# EAGLE schematic main (EAGLE 5.09)
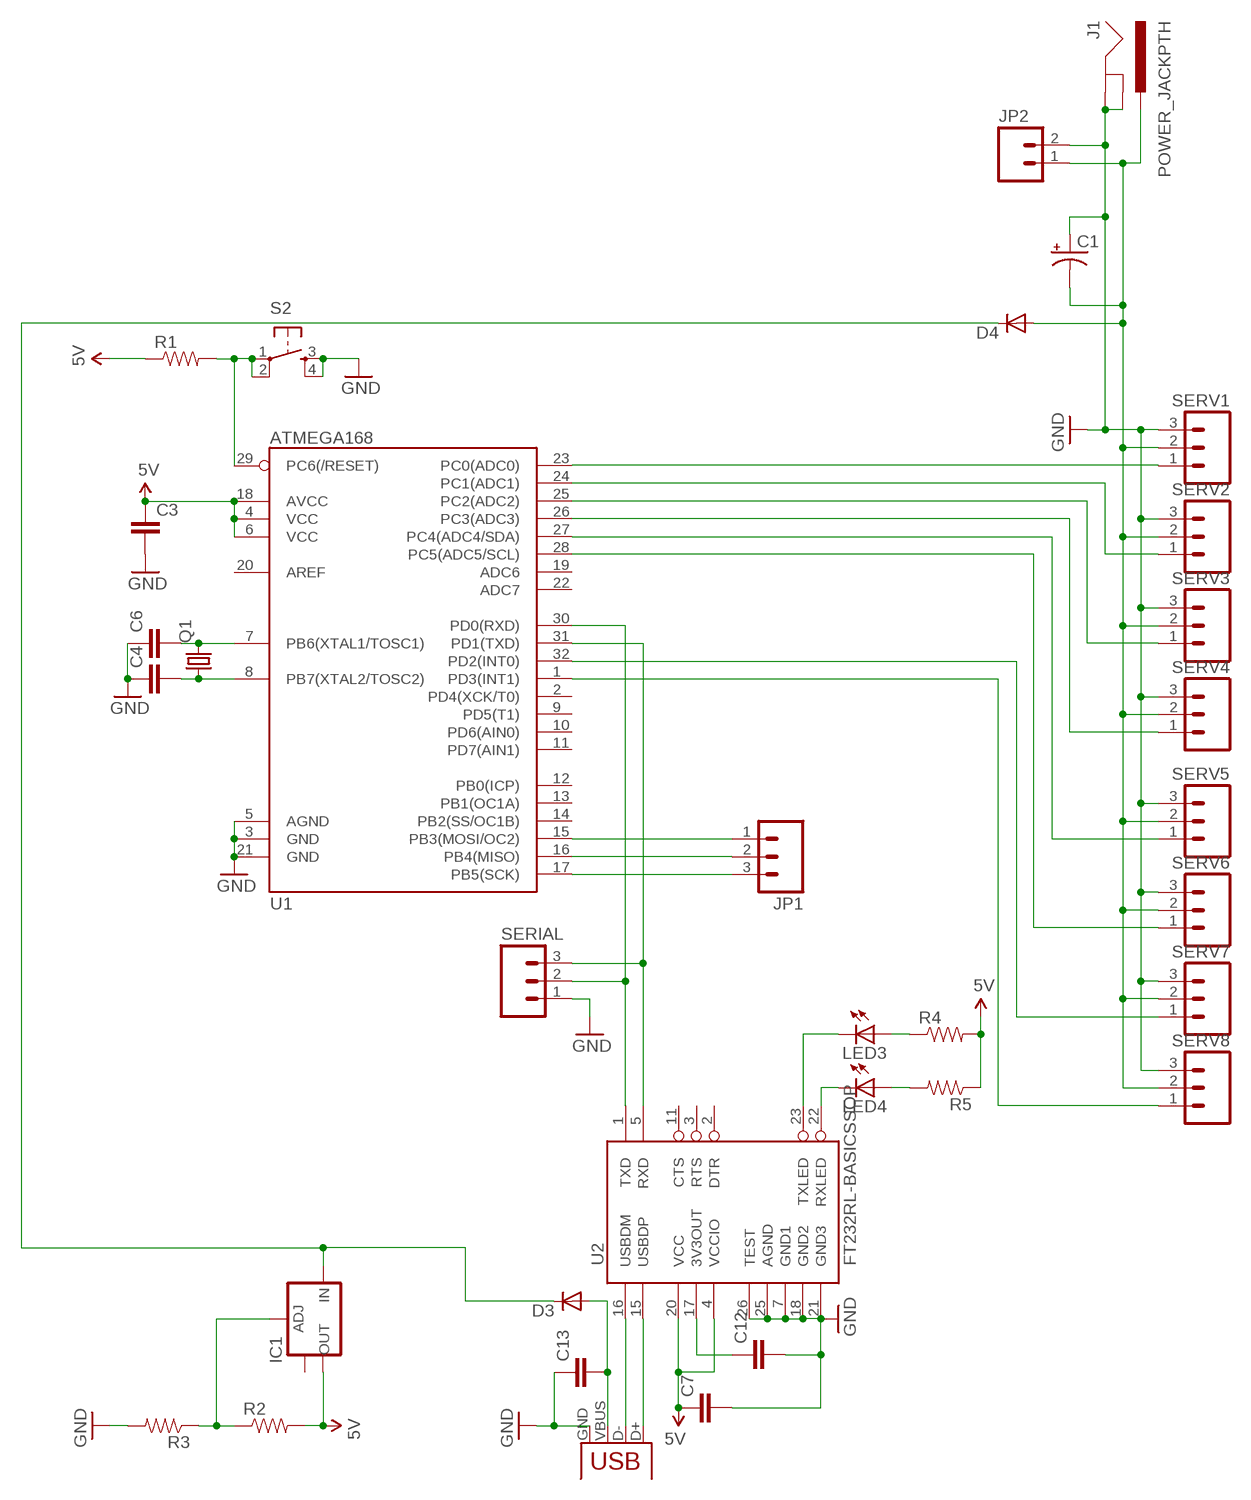
[diagram p0: schematic, sheet 1]

## Parts
C1  CAP_POLPTH2  [CPOL-RADIAL-10UF-25V]
C3  CAP1206  [1206]
C4  CAP1206  [1206]
C6  CAP1206  [1206]
C7  CAP1206  [1206]
C12  CAP1206  [1206]
C13  CAP1206  [1206]
D3  DIODESOT23  [SOT23-3]
D4  DIODESOT23  [SOT23-3]
IC1  V_REG_LM1117SOT223  [SOT223]
J1  POWER_JACKPTH  [POWER_JACK_PTH]
JP1  M03PTH  [1X03]
JP2  M02LOCK  [1X02_LOCK]
LED3  LED1206  [LED-1206]
LED4  LED1206  [LED-1206]
Q1  CRYSTAL5X3  [CRYSTAL-SMD-5X3]
R1  RESISTOR  [0805]
R2  RESISTOR  [0805]
R3  RESISTOR  [0805]
R4  RESISTOR  [0805]
R5  RESISTOR  [0805]
S2  TAC_SWITCHSMD  [TACTILE_SWITCH_SMD]
SERIAL  M03PTH  [1X03]
SERV1  M03LOCK  [1X03_LOCK]
SERV2  M03LOCK  [1X03_LOCK]
SERV3  M03LOCK  [1X03_LOCK]
SERV4  M03LOCK  [1X03_LOCK]
SERV5  M03LOCK  [1X03_LOCK]
SERV6  M03LOCK  [1X03_LOCK]
SERV7  M03LOCK  [1X03_LOCK]
SERV8  M03LOCK  [1X03_LOCK]
U1  ATMEGA168  [TQFP32-08]
U2  FT232RL-BASICSSOP  [SSOP28DB]
X2  USBSMD  [USB-MINIB]

## Nets
5V: C3.1 C7.1 IC1.2(OUT) R1.1 R2.2 R4.2 R5.1 U1.4(VCC) U1.6(VCC) U1.18(AVCC) U2.4(VCCIO) U2.20(VCC)
GND: C1.1(+) C3.2 C4.1 C6.1 C7.2 C12.2 C13.1 J1.GND J1.GNDBREAK JP2.2 R3.2 S2.3 S2.4 SERIAL.1 SERV1.3 SERV2.3 SERV3.3 SERV4.3 SERV5.3 SERV6.3 SERV7.3 SERV8.3 U1.3(GND) U1.5(AGND) U1.21(GND) U2.7(GND1) U2.18(GND2) U2.21(GND3) U2.25(AGND) U2.26(TEST) X2.GND
N$1: LED4.A R5.2
N$2: U2.16(USBDM) X2.D-
N$3: C6.2 Q1.3 U1.7(PB6(XTAL1/TOSC1))
N$4: C4.2 Q1.1 U1.8(PB7(XTAL2/TOSC2))
N$5: SERV1.1 U1.23(PC0(ADC0))
N$6: R1.2 S2.1 S2.2 U1.29(PC6(/RESET))
N$7: SERV2.1 U1.24(PC1(ADC1))
N$8: SERV3.1 U1.25(PC2(ADC2))
N$9: SERV4.1 U1.26(PC3(ADC3))
N$10: U2.15(USBDP) X2.D+
N$11: LED4.C U2.22(RXLED)
N$12: LED3.C U2.23(TXLED)
N$13: C12.1 U2.17(3V3OUT)
N$14: SERIAL.3 U1.31(PD1(TXD)) U2.5(RXD)
N$15: SERIAL.2 U1.30(PD0(RXD)) U2.1(TXD)
N$16: LED3.A R4.1
N$17: SERV5.1 U1.27(PC4(ADC4/SDA))
N$18: SERV6.1 U1.28(PC5(ADC5/SCL))
N$19: JP1.1 U1.15(PB3(MOSI/OC2))
N$20: JP1.2 U1.16(PB4(MISO))
N$21: JP1.3 U1.17(PB5(SCK))
N$22: SERV7.1 U1.32(PD2(INT0))
N$23: C1.2(-) D4.1(A) J1.PWR JP2.1 SERV1.2 SERV2.2 SERV3.2 SERV4.2 SERV5.2 SERV6.2 SERV7.2 SERV8.2
N$24: SERV8.1 U1.1(PD3(INT1))
N$25: C13.2 D3.1(A) X2.VBUS
N$27: IC1.1(ADJ) R2.1 R3.1
N$28: D3.3(C) D4.3(C) IC1.3(IN)
Unconnected: IC1.4(OUT) U1.2(PD4(XCK/T0)) U1.9(PD5(T1)) U1.10(PD6(AIN0)) U1.11(PD7(AIN1)) U1.12(PB0(ICP)) U1.13(PB1(OC1A)) U1.14(PB2(SS/OC1B)) U1.19(ADC6) U1.20(AREF) U1.22(ADC7) U2.2(DTR) U2.3(RTS) U2.11(CTS)

## Library data of the parts
C1 = SparkFun:CAP_POL: Capacitor Polarized These are standard SMD and PTH capacitors. Normally 10uF, 47uF, and 100uF in electrolytic and tantalum varieties. Always verify the external diameter of the through hole cap, it varies with capacity, voltage, and manufacturer. The EIA devices should be standard.
C3 C4 C6 C7 C12 C13 = SparkFun:CAP: Capacitor Standard 0603 ceramic capacitor, and 0.1" leaded capacitor.
D3 D4 = SparkFun:DIODE: Diode These are standard reverse protection diodes and small signal diodes. SMA package can handle up to about 1A. SOD-323 can handle about 200mA. What the SOD-323 package when ordering, there are some mfgs out there that are 5-pin packages.
IC1 = SparkFun:V_REG_LM1117: Voltage Regulator LM1117 Standard adjustable voltage regulator but in SMD form. Spark Fun Electronics SKU : COM-00595
J1 = SparkFun:POWER_JACK: Power Jack This is the standard 5.5mm barrel jack for power. The PTH is the most common, proven, reliable, footprint. All others are experimental. The Slot footprint only works if the mill layer is transmitted to the PCB fab house so be warned. Spark Fun Electronics SKU : PRT-00119. Mating wall wart : TOL-00298 (and others)
JP1 SERIAL SERV1-SERV8 = SparkFun:M03: Header 3 Standard 3-pin 0.1" header. Use with straight break away headers (SKU : PRT-00116), right angle break away headers (PRT-00553), swiss pins (PRT-00743), machine pins (PRT-00117), and female headers (PRT-00115). Molex polarized connector foot print use with SKU : PRT-08232 with associated crimp pins and housings.
JP2 = SparkFun:M02: Header 2 Standard 2-pin 0.1" header. Use with straight break away headers (SKU : PRT-00116), right angle break away headers (PRT-00553), swiss pins (PRT-00743), machine pins (PRT-00117), and female headers (PRT-00115). Molex polarized connector foot print use with SKU : PRT-08233 with associated crimp pins and housings.
LED3 LED4 = SparkFun:LED: LEDs Standard schematic elements and footprints for 5mm, 3mm, 1206, and 0603 sized LEDs. 5mm - Spark Fun Electronics SKU : COM-00529 (and others)
Q1 = SparkFun:CRYSTAL: Crystals Various standard crystals. Proven footprints. Spark Fun Electronics SKU : COM-00534
R1-R5 = SparkFun:RESISTOR: Resistor Basic schematic elements and footprints for 0603, 1206, and PTH 1/10th watt (small) resistors.
S2 = SparkFun:TAC_SWITCH: Momentary Switch Button commonly used for reset or general input. Spark Fun Electronics SKU : COM-00097
U1 = SparkFun:ATMEGA168
U2 = SparkFun:FT232RL-BASIC: USB UART This is the simplified version of the FT232RL unit. Only what you need, nothing you don't. Spark Fun Electronics SKU : COM-00650
X2 = SparkFun:USB: USB Connectors USB-B-PTH is fully proven SKU : PRT-00139 USB-miniB is fully proven SKU : PRT-00587 USB-A-PCB is untested. USB-A-H is throughly reviewed, but untested. Spark Fun Electronics SKU : PRT-00437 USB-B-SMT is throughly reviewed, but untested. Needs silkscreen touching up. USB-A-S has not been used/tested USB-MB-H has not been used/tested